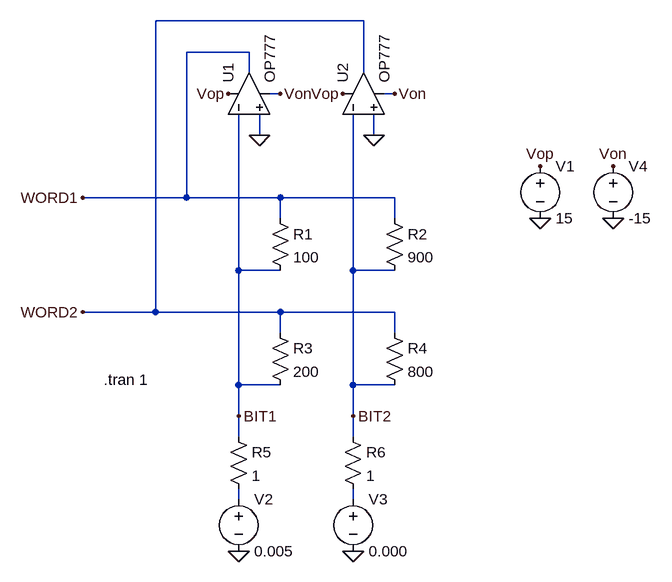
[diagram p0: schematic Week5_my_crossbar_inverse.asc]
Week5_my_crossbar_inverse.asc, the LTspice schematic file:
Version 4
SHEET 1 880 788
WIRE 256 -208 -64 -208
WIRE 80 -160 -16 -160
WIRE 80 -128 80 -160
WIRE 256 -128 256 -208
WIRE 128 -96 112 -96
WIRE 304 -96 288 -96
WIRE 96 -32 96 -64
WIRE 272 -32 272 -64
WIRE -16 64 -16 -160
WIRE -16 64 -176 64
WIRE 128 64 -16 64
WIRE 304 64 128 64
WIRE 128 96 128 64
WIRE 304 96 304 64
WIRE 64 176 64 -64
WIRE 128 176 64 176
WIRE 240 176 240 -64
WIRE 304 176 240 176
WIRE -64 240 -64 -208
WIRE -64 240 -176 240
WIRE 128 240 -64 240
WIRE 304 240 128 240
WIRE 128 272 128 240
WIRE 304 272 304 240
WIRE 64 352 64 176
WIRE 128 352 64 352
WIRE 240 352 240 176
WIRE 304 352 240 352
WIRE 64 400 64 352
WIRE 240 400 240 352
WIRE 64 432 64 400
WIRE 240 432 240 400
WIRE 64 528 64 512
WIRE 240 528 240 512
FLAG -176 64 WORD1
FLAG -176 240 WORD2
FLAG 96 -32 0
FLAG 272 -32 0
FLAG 48 -96 Vop
FLAG 224 -96 Vop
FLAG 528 16 Vop
FLAG 528 96 0
FLAG 64 608 0
FLAG 240 608 0
FLAG 640 96 0
FLAG 640 16 Von
FLAG 304 -96 Von
FLAG 128 -96 Von
FLAG 64 400 BIT1
FLAG 240 400 BIT2
SYMBOL res 112 80 R0
SYMATTR InstName R1
SYMATTR Value 100
SYMBOL res 288 80 R0
SYMATTR InstName R2
SYMATTR Value 900
SYMBOL res 112 256 R0
SYMATTR InstName R3
SYMATTR Value 200
SYMBOL res 288 256 R0
SYMATTR InstName R4
SYMATTR Value 800
SYMBOL res 48 416 R0
SYMATTR InstName R5
SYMATTR Value 1
SYMBOL res 224 416 R0
SYMATTR InstName R6
SYMATTR Value 1
SYMBOL voltage 528 0 R0
WINDOW 123 0 0 Left 0
WINDOW 39 0 0 Left 0
SYMATTR InstName V1
SYMATTR Value 15
SYMBOL voltage 64 512 R0
WINDOW 123 0 0 Left 0
WINDOW 39 0 0 Left 0
SYMATTR InstName V2
SYMATTR Value 0.005
SYMBOL voltage 240 512 R0
WINDOW 123 0 0 Left 0
WINDOW 39 0 0 Left 0
SYMATTR InstName V3
SYMATTR Value 0.000
SYMBOL voltage 640 0 R0
WINDOW 123 0 0 Left 0
WINDOW 39 0 0 Left 0
SYMATTR InstName V4
SYMATTR Value -15
SYMBOL OpAmps\\OP777 16 -96 R270
SYMATTR InstName U1
SYMBOL OpAmps\\OP777 192 -96 R270
SYMATTR InstName U2
TEXT -144 344 Left 2 !.tran 1

The netlist it stands for:
* Week5_my_crossbar_inverse.asc
R1 WORD1 BIT1 100
R2 WORD1 BIT2 900
R3 WORD2 BIT1 200
R4 WORD2 BIT2 800
R5 BIT1 N001 1
R6 BIT2 N002 1
V1 Vop 0 15
V2 N001 0 0.005
V3 N002 0 0.000
V4 Von 0 -15
XU1 0 BIT1 Vop Von WORD1 OP777  ; pins In+ In- V+ V- OUT
XU2 0 BIT2 Vop Von WORD2 OP777  ; pins In+ In- V+ V- OUT
.tran 1
.lib ADI.lib
.backanno
.end